# EasyEDA schematic SCH_10_28_2022_R3_HARWARE_TRAININGMODULE3_2022-10-29.json
TITLE: R3 HARDWARE TRAINING MODULE 3; REV: 1.0; Date: 2022-10-28; Sheet: 1/1; Drawn By: ARAVEINTH G.; Company: R3
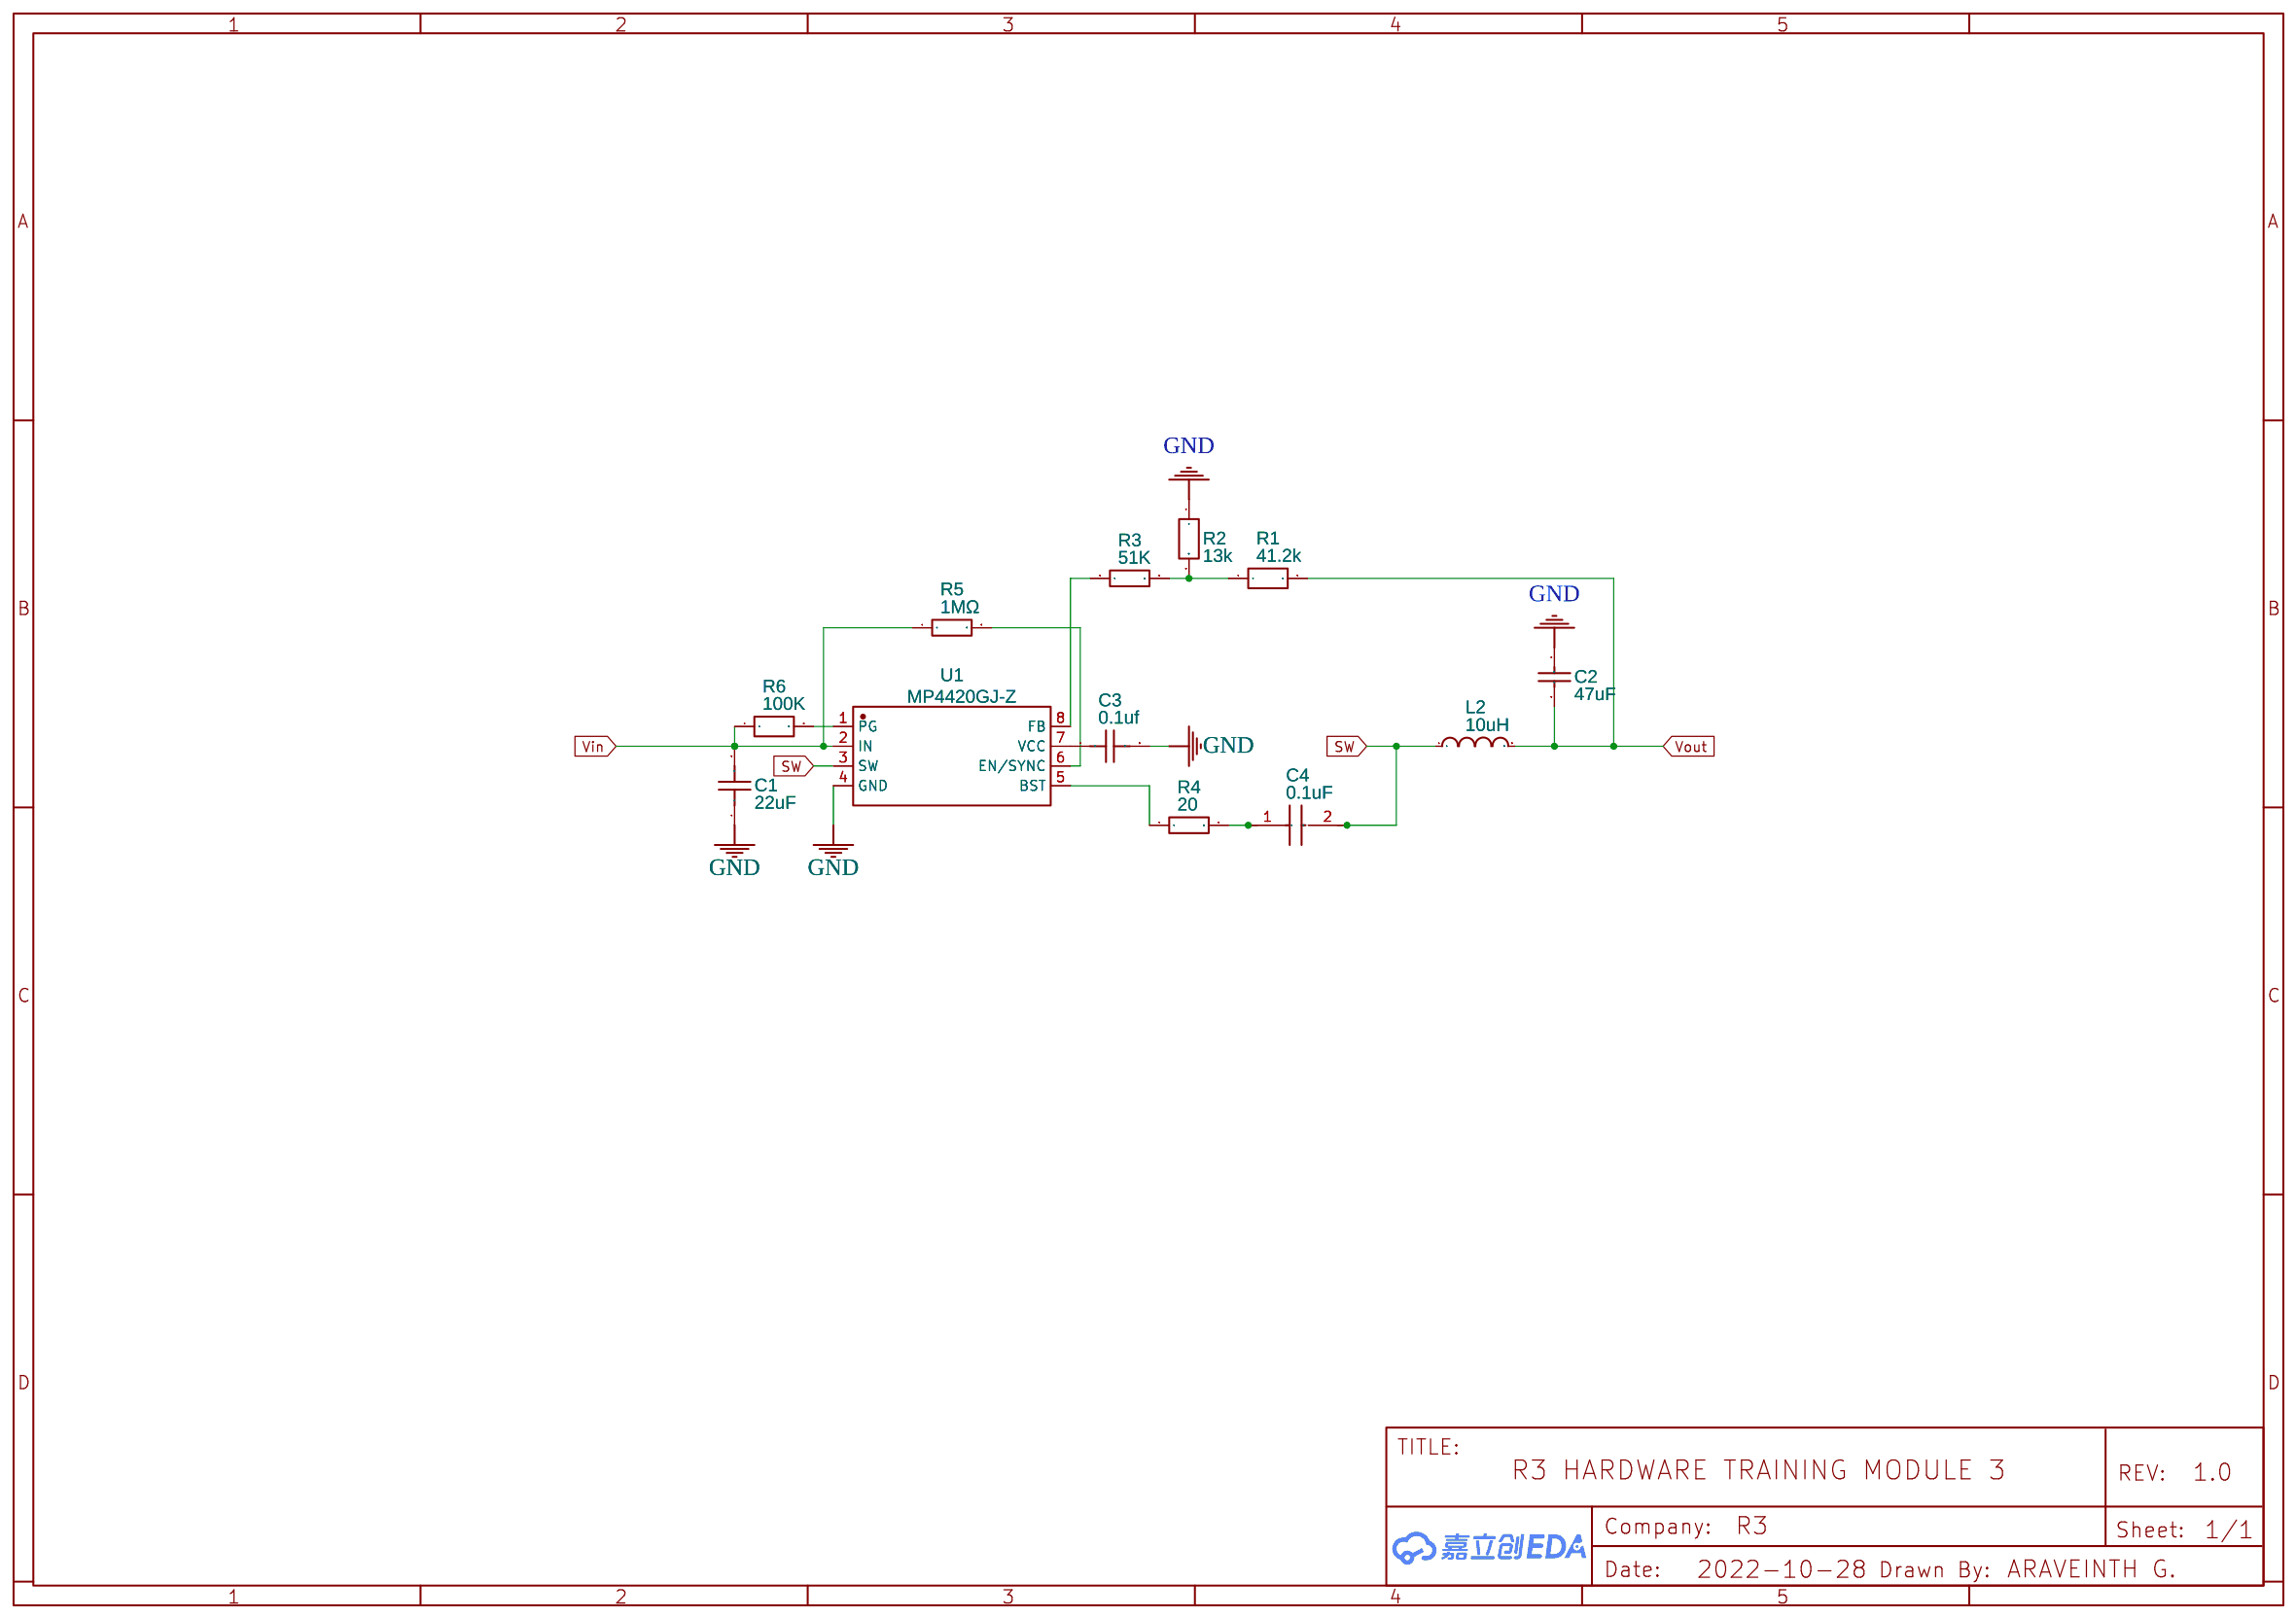
[diagram p0: schematic sheet]

## Parts
C1  22uF  [C0603]
C2  47uF  [C1206]
C3  0.1uf  [C0201]
C4  0.1uF  [CAPC0603X33N]
L2  10uH  [IND-SMD_B82559A7103A025]
R1  41.2k  [R1206]
R2  13k  [R1206]
R3  51K  [R1206]
R4  20  [R1206]
R5  1MΩ  [R1206]
R6  100K  [R1206]
U1  MP4420GJ-Z  [TSOT-23-8_L2.9-W1.6-P0.65-LS2.8-BL]

## Library data of the parts
C1 = CL10A226MO7JZNC: Supplier: Digi-Key; Supplier Part: 1276-7076-1-ND; Manufacturer: Samsung Electro-Mechanics; Contributor: MladenGavric; link: https://eu.mouser.com/datasheet/2/585/MLCC-1837944.pdf; Package Display: No
C2 = CL31A476MQHNNNE: Supplier: Digi-Key; Manufacturer: Samsung Electro-Mechanics; Supplier Part: 1276-1167-1-ND; JLCPCB Part Class: Extended Part
C3 = GRM033R6YA104KE14D: Supplier: Digi-Key; Supplier Part: 490-10430-1-ND; Manufacturer: Murata Electronics; Contributor: LCSC; JLCPCB Part Class: Extended Part
C4 = 02016D104KAT2A: Contributor: S5 Solutions; Manufacturer Part: CAP CER 0.1UF 6.3V X5R 0201; Supplier: Digi-Key; Supplier Part: 478-5266-1-ND
L2 = B82559A7103A025: Supplier: Digi-Key; Supplier Part: C1329446; Manufacturer: EPCOS - TDK Electronics; JLCPCB Part Class: Extended Part; Contributor: lcsc
R1 = RC1206FR-0741K2L: Supplier: Digi-Key; Supplier Part: 311-41.2KFRCT-ND; Manufacturer: YAGEO; Contributor: LCSC; Resistance: 41.2kΩ; JLCPCB Part Class: Extended Part
R2 = RC1206FR-0713KL: Supplier: Digi-Key; Supplier Part: 311-13.0KFRCT-ND; Manufacturer: YAGEO; Contributor: LCSC; JLCPCB Part Class: Extended Part; Resistance: 13kΩ
R3 = RC1206JR-0751KL: Supplier: Digi-Key; Manufacturer: YAGEO; Supplier Part: 311-51KERCT-ND; JLCPCB Part Class: Extended Part; Resistance: 51kΩ
R4 = RC1206JR-0720RL: Supplier: Digi-Key; Manufacturer: YAGEO; Supplier Part: 311-20ERCT-ND; JLCPCB Part Class: Extended Part; Resistance: 20Ω
R5 = RMCF1206JT1M00: Supplier: Digi-Key; Supplier Part: RMCF1206JT1M00CT-ND; Manufacturer: Stackpole Electronics Inc; Resistance (Ohms): 1M; Contributor: LCSC; JLCPCB Part Class: Extended Part
R6 = AC1206JR-07100KL: Supplier: Digi-Key; Supplier Part: YAG3912CT-ND; Manufacturer: YAGEO; Contributor: LCSC; Resistance: 100kΩ; JLCPCB Part Class: Extended Part
U1 = MP4420GJ-P: Supplier: Digi-Key; Manufacturer: Monolithic Power Systems Inc.; Contributor: abaurin; Supplier Part: 1589-MP4420GJ-ZCT-ND; JLCPCB Part Class: Extended Part

## Nets
GND: C1.1 C2.1 C3.2 R2.1 U1.4(GND)
Vin: C1.2 R5.1 R6.1 U1.2(IN)
SW: C4.2 L2.1 U1.3(SW)
Vout: C2.2 L2.2 R1.2
Net-(C3-1): C3.1 U1.7(VCC)
Net-(C4-1): C4.1 R4.2
Net-(R1-1): R1.1 R2.2 R3.2
Net-(R3-1): R3.1 U1.8(FB)
Net-(R4-1): R4.1 U1.5(BST)
Net-(R5-2): R5.2 U1.6(EN/SYNC)
Net-(R6-2): R6.2 U1.1(PG)
